# Altium project 5_TPS7A49可调低压降稳压器.PrjPcb
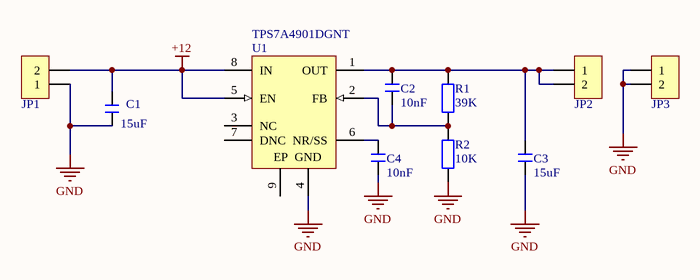
[diagram p0: 5_TPS7A49可调低压降稳压器.SchDoc]
1 sheet, 10 parts. Net scope: global (net labels, ports and power ports of the same name join across sheets).
Board file: 5_TPS7A49可调低压降稳压器.PcbDoc

## Sheet 5_TPS7A49可调低压降稳压器.SchDoc
size A4; SheetNumber: 1; SheetTotal: 1

### Parts
C1  15uF  [C 0805_L]
C2  10nF  [C 0805_L]
C3  15uF  [C 0805_L]
C4  10nF  [C 0805_L]
JP1  HDR-1X2  [KF2EDGK5.08-WI-2P]  (value not drawn)
JP2  HDR-1X2  [HDR2.54-WS-2P]  (value not drawn)
JP3  HDR-1X2  [HDR2.54-WS-2P]  (value not drawn)
R1  39K  [R 0805_L]
R2  10K  [R 0805_L]
U1  TPS7A4901DGNT  [DGN0008D_M]

### Nets
+12: C1.2 JP1.2 U1.5(EN) U1.8(IN)
GND: C1.1 C3.1 C4.1 JP1.1 JP3.1 JP3.2 R2.1 U1.4(GND)
NetC2_1: C2.1 R1.1 R2.2 U1.2(FB)
NetC2_2: C2.2 C3.2 JP2.1 JP2.2 R1.2 U1.1(OUT)
NetC4_2: C4.2 U1.6(NR/SS)

Not connected (* = marked no-connect by the designer): U1 3(NC) 7(DNC) 9(EP)

### Library data of the parts
C1-C4 = C: 贴片电容; 淘宝ID: 小糖豆的小窝窝; BOM名称: 贴片电容; 下单链接: https://item.taobao.com/item.htm?ft=t&id=613637044352
JP1-JP3 = Header 2: 2P接插件; 淘宝ID: 小糖豆的小窝窝; BOM名称: 2P接插件; 下单链接: https://item.taobao.com/item.htm?ft=t&id=613637044352
R1 R2 = R: 贴片电阻; 淘宝ID: 小糖豆的小窝窝; BOM名称: 贴片电阻; 下单链接: https://item.taobao.com/item.htm?ft=t&id=613637044352
U1 = CMP-0394-01238-2: Single Output High PSRR LDO, 150 mA, Adjustable 1.2 to 33 V Output, 3 to 36 V Input, with Ultra-Low Noise, 8-pin MSOP (DGN), -40 to 125 degC, Green (RoHS & no Sb/Br); Manufacturer: Texas Instruments; Vout Adj(Min)(V): 1.2; Vout Adj(Max)(V): 33; SubFamily: Single Channel LDO; Vin(Max)(V): 36; Iq(Typ)(mA): 0.06; Power Good: TRUE; Vdo(Typ)(mV): 260; Accuracy(%): 1.5; Iout(Max)(A): 0.15; Vin(Min)(V): 3; PackageDescription: 8-pin Plastic Small Outline, Body 3 x 3 mm, Pitch 0.65 mm; Code_JEDEC: MO-187; ComponentLink2URL: http://www.ti.com/general/docs/lit/getliterature.tsp?genericPartNumber=TPS7A4901&fileType=pdf; Mounting Technology: Surface Mount; PackageVersion: 4073271/F; ComponentLink1URL: http://www.ti.com/; PackageReference: DGN0008D; Eco-Plan: Green (RoHS & no Sb/Br); PartNumber: TPS7A4901DGNT; DatasheetVersion: SBVS121B; ComponentLink2Description: Datasheet; ComponentLink3Description: Package Specification; ComponentLink1Description: Manufacturer URL; ComponentLink3URL: http://www.ti.com/litv/pdf/mpds046e